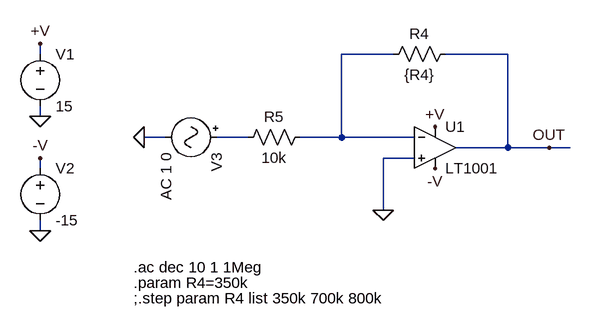
[diagram p0: schematic 06-rc-phase-shift-oscillator-amplifier.asc]
06-rc-phase-shift-oscillator-amplifier.asc, the LTspice schematic file:
Version 4.1
SHEET 1 1140 1108
WIRE -720 272 -720 256
WIRE -176 272 -256 272
WIRE 0 272 -96 272
WIRE -720 368 -720 352
WIRE -528 400 -560 400
WIRE -400 400 -448 400
WIRE -256 400 -256 272
WIRE -256 400 -320 400
WIRE -144 400 -256 400
WIRE 0 416 0 272
WIRE 0 416 -80 416
WIRE 64 416 0 416
WIRE 96 416 64 416
WIRE -144 432 -192 432
WIRE -720 448 -720 432
WIRE -192 512 -192 432
WIRE -720 544 -720 528
FLAG -112 384 +V
FLAG -112 448 -V
FLAG -720 256 +V
FLAG -720 544 0
FLAG -720 368 0
FLAG -720 432 -V
FLAG -192 512 0
FLAG -560 400 0
FLAG 64 416 OUT
SYMBOL voltage -720 256 R0
SYMATTR InstName V1
SYMATTR Value 15
SYMBOL voltage -720 432 R0
SYMATTR InstName V2
SYMATTR Value -15
SYMBOL res -192 288 R270
WINDOW 0 32 56 VTop 2
WINDOW 3 0 56 VBottom 2
SYMATTR InstName R4
SYMATTR Value {R4}
SYMBOL res -416 416 R270
WINDOW 0 32 56 VTop 2
WINDOW 3 0 56 VBottom 2
SYMATTR InstName R5
SYMATTR Value 10k
SYMBOL OpAmps\\LT1001 -112 352 R0
SYMATTR InstName U1
SYMBOL Misc\\signal -432 400 R90
WINDOW 123 24 94 Left 2
WINDOW 39 0 0 Left 0
SYMATTR InstName V3
SYMATTR Value ""
SYMATTR Value2 AC 1 0
TEXT -576 624 Left 2 !.param R4=350k
TEXT -576 648 Left 2 !;.step param R4 list 350k 700k 800k
TEXT -576 600 Left 2 !.ac dec 10 1 1Meg

The netlist it stands for:
* 06-rc-phase-shift-oscillator-amplifier.asc
V1 +V 0 15
V2 -V 0 -15
R4 N001 OUT {R4}
R5 N002 N001 10k
X§U1 0 N001 +V -V OUT LT1001  ; pins In+ In- V+ V- OUT
V3 N002 0 AC 1 0
.param R4=350k
;.step param R4 list 350k 700k 800k
.ac dec 10 1 1Meg
.lib LTC.lib
.backanno
.end